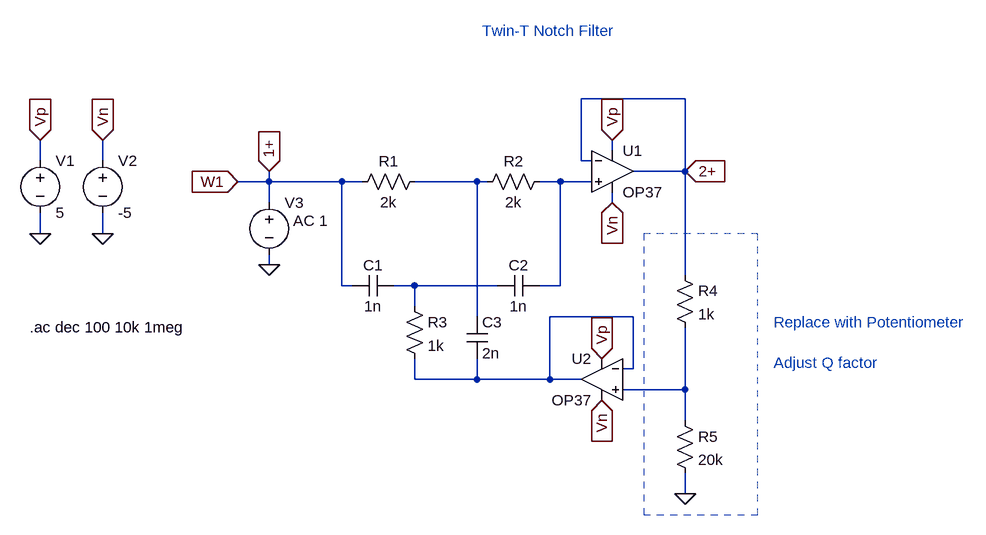
[diagram p0: schematic twint_notch.asc]
twint_notch.asc, the LTspice schematic file:
Version 4
SHEET 1 1036 724
WIRE 576 32 416 32
WIRE 464 112 464 96
WIRE -416 128 -416 96
WIRE -320 128 -320 96
WIRE 416 128 416 32
WIRE 432 128 416 128
WIRE 576 144 576 32
WIRE 576 144 496 144
WIRE -64 160 -64 144
WIRE -64 160 -112 160
WIRE 48 160 -64 160
WIRE 80 160 48 160
WIRE 256 160 160 160
WIRE 272 160 256 160
WIRE 384 160 352 160
WIRE 432 160 384 160
WIRE -64 192 -64 160
WIRE 464 192 464 176
WIRE -416 240 -416 208
WIRE -320 240 -320 208
WIRE -64 288 -64 272
WIRE 576 304 576 144
WIRE 48 320 48 160
WIRE 64 320 48 320
WIRE 160 320 128 320
WIRE 288 320 160 320
WIRE 384 320 384 160
WIRE 384 320 352 320
WIRE 160 352 160 320
WIRE 256 368 256 160
WIRE 496 368 368 368
WIRE 496 448 496 368
WIRE 496 448 480 448
WIRE 160 464 160 432
WIRE 256 464 256 432
WIRE 256 464 160 464
WIRE 368 464 368 368
WIRE 368 464 256 464
WIRE 416 464 368 464
WIRE 576 480 576 384
WIRE 576 480 480 480
WIRE 576 528 576 480
WIRE 576 640 576 608
FLAG 464 96 Vp
IOPIN 464 96 In
FLAG 464 192 Vn
IOPIN 464 192 In
FLAG -416 240 0
FLAG -320 240 0
FLAG -416 96 Vp
IOPIN -416 96 In
FLAG -320 96 Vn
IOPIN -320 96 In
FLAG -64 288 0
FLAG -112 160 W1
IOPIN -112 160 In
FLAG -64 144 1+
IOPIN -64 144 In
FLAG 448 432 Vp
IOPIN 448 432 In
FLAG 448 496 Vn
IOPIN 448 496 In
FLAG 576 144 2+
IOPIN 576 144 In
FLAG 576 640 0
SYMBOL cap 128 304 R90
WINDOW 0 0 32 VBottom 2
WINDOW 3 32 32 VTop 2
SYMATTR InstName C1
SYMATTR Value 1n
SYMBOL res 368 144 R90
WINDOW 0 0 56 VBottom 2
WINDOW 3 32 56 VTop 2
SYMATTR InstName R2
SYMATTR Value 2k
SYMBOL Opamps\\OP37 464 80 R0
SYMATTR InstName U1
SYMBOL voltage -416 112 R0
WINDOW 123 0 0 Left 0
WINDOW 39 0 0 Left 0
SYMATTR InstName V1
SYMATTR Value 5
SYMBOL voltage -320 112 R0
WINDOW 123 0 0 Left 0
WINDOW 39 0 0 Left 0
SYMATTR InstName V2
SYMATTR Value -5
SYMBOL voltage -64 176 R0
WINDOW 123 37 44 Left 2
WINDOW 39 0 0 Left 0
SYMATTR Value2 AC 1
SYMATTR InstName V3
SYMATTR Value ""
SYMBOL cap 352 304 R90
WINDOW 0 0 32 VBottom 2
WINDOW 3 32 32 VTop 2
SYMATTR InstName C2
SYMATTR Value 1n
SYMBOL res 144 336 R0
SYMATTR InstName R3
SYMATTR Value 1k
SYMBOL res 176 144 R90
WINDOW 0 0 56 VBottom 2
WINDOW 3 32 56 VTop 2
SYMATTR InstName R1
SYMATTR Value 2k
SYMBOL Opamps\\OP37 448 400 M0
SYMATTR InstName U2
SYMBOL res 560 288 R0
SYMATTR InstName R4
SYMATTR Value 1k
SYMBOL cap 240 368 R0
SYMATTR InstName C3
SYMATTR Value 2n
SYMBOL res 560 512 R0
SYMATTR InstName R5
SYMATTR Value 20k
TEXT -432 384 Left 2 !.ac dec 100 10k 1meg
TEXT 264 -72 Left 2 ;Twin-T Notch Filter
TEXT 712 376 Left 2 ;Replace with Potentiometer\n \nAdjust Q factor
RECTANGLE Normal 512 672 688 240 2

The netlist it stands for:
* twint_notch.asc
C1 N003 1+ 1n
R2 N002 N001 2k
XU1 N002 2+ Vp Vn 2+ LT1037  ; OP37, pins In+ In- V+ V- OUT
V1 Vp 0 5
V2 Vn 0 -5
V3 1+ 0 AC 1
C2 N002 N003 1n
R3 N003 N004 1k
R1 N001 1+ 2k
XU2 N005 N004 Vp Vn N004 LT1037  ; OP37, pins In+ In- V+ V- OUT
R4 2+ N005 1k
C3 N001 N004 2n
R5 N005 0 20k
.ac dec 100 10k 1meg
* Twin-T Notch Filter
* Replace with Potentiometer
* Adjust Q factor
.lib LTC.lib
.backanno
.end